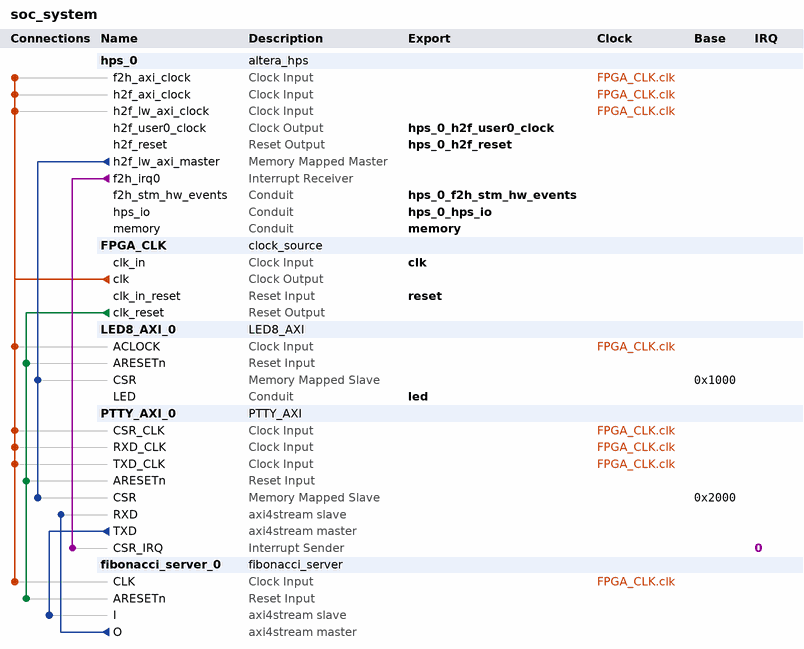
[diagram p0: system contents]
# Platform Designer (Qsys) system soc_system, Cyclone V 5CSEMA4U23C6
# Parameters at their usual value, and those the tool derives, are not listed.
package require -exact qsys 15.1
create_system soc_system
set_project_property DEVICE_FAMILY {Cyclone V}
set_project_property DEVICE 5CSEMA4U23C6

add_instance hps_0 altera_hps 15.1
set_instance_parameter_value hps_0 EMAC1_Mode RGMII
set_instance_parameter_value hps_0 EMAC1_PinMuxing {HPS I/O Set 0}
set_instance_parameter_value hps_0 F2SCLK_COLDRST_Enable false
set_instance_parameter_value hps_0 F2SCLK_DBGRST_Enable false
set_instance_parameter_value hps_0 F2SCLK_WARMRST_Enable false
set_instance_parameter_value hps_0 F2SINTERRUPT_Enable true
set_instance_parameter_value hps_0 F2S_Width 3
set_instance_parameter_value hps_0 FPGA_PERIPHERAL_OUTPUT_CLOCK_FREQ_EMAC0_GTX_CLK 100
set_instance_parameter_value hps_0 FPGA_PERIPHERAL_OUTPUT_CLOCK_FREQ_EMAC0_MD_CLK 100.0
set_instance_parameter_value hps_0 FPGA_PERIPHERAL_OUTPUT_CLOCK_FREQ_EMAC1_GTX_CLK 100
set_instance_parameter_value hps_0 FPGA_PERIPHERAL_OUTPUT_CLOCK_FREQ_EMAC1_MD_CLK 100.0
set_instance_parameter_value hps_0 HPS_PROTOCOL DDR3
set_instance_parameter_value hps_0 I2C0_Mode I2C
set_instance_parameter_value hps_0 I2C0_PinMuxing {HPS I/O Set 0}
set_instance_parameter_value hps_0 I2C1_Mode I2C
set_instance_parameter_value hps_0 I2C1_PinMuxing {HPS I/O Set 0}
set_instance_parameter_value hps_0 LWH2F_Enable true
set_instance_parameter_value hps_0 MEM_BANKADDR_WIDTH 3
set_instance_parameter_value hps_0 MEM_CLK_FREQ 400.0
set_instance_parameter_value hps_0 MEM_COL_ADDR_WIDTH 10
set_instance_parameter_value hps_0 MEM_DQ_WIDTH 32
set_instance_parameter_value hps_0 MEM_DRV_STR RZQ/6
set_instance_parameter_value hps_0 MEM_ROW_ADDR_WIDTH 15
set_instance_parameter_value hps_0 MEM_RTT_NOM RZQ/6
set_instance_parameter_value hps_0 MEM_RTT_WR {Dynamic ODT off}
set_instance_parameter_value hps_0 MEM_TCL 7
set_instance_parameter_value hps_0 MEM_TFAW_NS 37.5
set_instance_parameter_value hps_0 MEM_TRAS_NS 35.0
set_instance_parameter_value hps_0 MEM_TRCD_NS 13.75
set_instance_parameter_value hps_0 MEM_TRFC_NS 300.0
set_instance_parameter_value hps_0 MEM_TRP_NS 13.75
set_instance_parameter_value hps_0 MEM_VENDOR Other
set_instance_parameter_value hps_0 MEM_WTCL 7
set_instance_parameter_value hps_0 QSPI_Mode N/A
set_instance_parameter_value hps_0 QSPI_PinMuxing Unused
set_instance_parameter_value hps_0 REF_CLK_FREQ 25.0
set_instance_parameter_value hps_0 S2FCLK_USER0CLK_Enable true
set_instance_parameter_value hps_0 S2FCLK_USER2CLK 1
set_instance_parameter_value hps_0 S2F_Width 2
set_instance_parameter_value hps_0 SDIO_Mode {4-bit Data}
set_instance_parameter_value hps_0 SDIO_PinMuxing {HPS I/O Set 0}
set_instance_parameter_value hps_0 SPIM1_Mode {Single Slave Select}
set_instance_parameter_value hps_0 SPIM1_PinMuxing {HPS I/O Set 0}
set_instance_parameter_value hps_0 STM_Enable true
set_instance_parameter_value hps_0 TIMING_BOARD_AC_SKEW 0.02
set_instance_parameter_value hps_0 TIMING_BOARD_AC_TO_CK_SKEW 0.0
set_instance_parameter_value hps_0 TIMING_BOARD_DQ_TO_DQS_SKEW 0.0
set_instance_parameter_value hps_0 TIMING_BOARD_MAX_CK_DELAY 0.6
set_instance_parameter_value hps_0 TIMING_BOARD_MAX_DQS_DELAY 0.6
set_instance_parameter_value hps_0 TIMING_BOARD_SKEW_BETWEEN_DQS 0.02
set_instance_parameter_value hps_0 TIMING_BOARD_SKEW_CKDQS_DIMM_MAX 0.01
set_instance_parameter_value hps_0 TIMING_BOARD_SKEW_CKDQS_DIMM_MIN -0.01
set_instance_parameter_value hps_0 TIMING_BOARD_SKEW_WITHIN_DQS 0.02
set_instance_parameter_value hps_0 TIMING_TDH 125
set_instance_parameter_value hps_0 TIMING_TDQSCK 400
set_instance_parameter_value hps_0 TIMING_TDQSQ 120
set_instance_parameter_value hps_0 TIMING_TDS 50
set_instance_parameter_value hps_0 TIMING_TIH 250
set_instance_parameter_value hps_0 TIMING_TIS 175
set_instance_parameter_value hps_0 TIMING_TQSH 0.38
set_instance_parameter_value hps_0 UART0_Mode {No Flow Control}
set_instance_parameter_value hps_0 UART0_PinMuxing {HPS I/O Set 0}
set_instance_parameter_value hps_0 USB1_Mode SDR
set_instance_parameter_value hps_0 USB1_PinMuxing {HPS I/O Set 0}
set_instance_parameter_value hps_0 desired_cfg_clk_mhz 100.0
set_instance_parameter_value hps_0 desired_qspi_clk_mhz 370.0

add_instance FPGA_CLK clock_source 15.1
set_instance_parameter_value FPGA_CLK clockFrequency 50000000

add_instance LED8_AXI_0 LED8_AXI 1.0
set_instance_parameter_value LED8_AXI_0 C_ADDR_WIDTH 12
set_instance_parameter_value LED8_AXI_0 C_DATA_WIDTH 32
set_instance_parameter_value LED8_AXI_0 C_ID_WIDTH 12
set_instance_parameter_value LED8_AXI_0 DEFAULT_SEQ_0 24
set_instance_parameter_value LED8_AXI_0 DEFAULT_SEQ_1 36
set_instance_parameter_value LED8_AXI_0 DEFAULT_SEQ_2 66
set_instance_parameter_value LED8_AXI_0 DEFAULT_SEQ_3 129
set_instance_parameter_value LED8_AXI_0 DEFAULT_SEQ_4 66
set_instance_parameter_value LED8_AXI_0 DEFAULT_SEQ_5 36
set_instance_parameter_value LED8_AXI_0 DEFAULT_SEQ_6 0
set_instance_parameter_value LED8_AXI_0 DEFAULT_SEQ_7 0
set_instance_parameter_value LED8_AXI_0 DEFAULT_SEQ_LAST 5
set_instance_parameter_value LED8_AXI_0 DEFAULT_TIMER 100000000

add_instance PTTY_AXI_0 PTTY_AXI 1.0
set_instance_parameter_value PTTY_AXI_0 CSR_ADDR_WIDTH 12
set_instance_parameter_value PTTY_AXI_0 CSR_DATA_WIDTH 32
set_instance_parameter_value PTTY_AXI_0 CSR_ID_WIDTH 12
set_instance_parameter_value PTTY_AXI_0 RXD_BUF_DEPTH 7
set_instance_parameter_value PTTY_AXI_0 RXD_BYTES 4
set_instance_parameter_value PTTY_AXI_0 TXD_BUF_DEPTH 7
set_instance_parameter_value PTTY_AXI_0 TXD_BYTES 4

add_instance fibonacci_server_0 fibonacci_server 1.0
set_instance_parameter_value fibonacci_server_0 I_BYTES 4
set_instance_parameter_value fibonacci_server_0 O_BYTES 4

# connections
add_connection FPGA_CLK.clk fibonacci_server_0.CLK clock
add_connection FPGA_CLK.clk hps_0.f2h_axi_clock clock
add_connection FPGA_CLK.clk hps_0.h2f_axi_clock clock
add_connection FPGA_CLK.clk hps_0.h2f_lw_axi_clock clock
add_connection FPGA_CLK.clk LED8_AXI_0.ACLOCK clock
add_connection FPGA_CLK.clk PTTY_AXI_0.CSR_CLK clock
add_connection FPGA_CLK.clk PTTY_AXI_0.RXD_CLK clock
add_connection FPGA_CLK.clk PTTY_AXI_0.TXD_CLK clock
add_connection FPGA_CLK.clk_reset fibonacci_server_0.ARESETn reset
add_connection FPGA_CLK.clk_reset LED8_AXI_0.ARESETn reset
add_connection FPGA_CLK.clk_reset PTTY_AXI_0.ARESETn reset
add_connection hps_0.h2f_lw_axi_master LED8_AXI_0.CSR avalon
set_connection_parameter_value hps_0.h2f_lw_axi_master/LED8_AXI_0.CSR baseAddress 0x1000
add_connection hps_0.h2f_lw_axi_master PTTY_AXI_0.CSR avalon
set_connection_parameter_value hps_0.h2f_lw_axi_master/PTTY_AXI_0.CSR baseAddress 0x2000
add_connection fibonacci_server_0.O PTTY_AXI_0.RXD axi4stream
add_connection PTTY_AXI_0.TXD fibonacci_server_0.I axi4stream
add_connection hps_0.f2h_irq0 PTTY_AXI_0.CSR_IRQ interrupt
set_connection_parameter_value hps_0.f2h_irq0/PTTY_AXI_0.CSR_IRQ irqNumber 0

# exported interfaces
add_interface clk clock sink
set_interface_property clk EXPORT_OF FPGA_CLK.clk_in
add_interface hps_0_f2h_stm_hw_events conduit end
set_interface_property hps_0_f2h_stm_hw_events EXPORT_OF hps_0.f2h_stm_hw_events
add_interface hps_0_h2f_reset reset source
set_interface_property hps_0_h2f_reset EXPORT_OF hps_0.h2f_reset
add_interface hps_0_h2f_user0_clock clock source
set_interface_property hps_0_h2f_user0_clock EXPORT_OF hps_0.h2f_user0_clock
add_interface hps_0_hps_io conduit end
set_interface_property hps_0_hps_io EXPORT_OF hps_0.hps_io
add_interface led conduit end
set_interface_property led EXPORT_OF LED8_AXI_0.LED
add_interface memory conduit end
set_interface_property memory EXPORT_OF hps_0.memory
add_interface reset reset sink
set_interface_property reset EXPORT_OF FPGA_CLK.clk_in_reset

set_interconnect_requirement {$system} qsys_mm.clockCrossingAdapter HANDSHAKE
set_interconnect_requirement {$system} qsys_mm.maxAdditionalLatency 1

save_system soc_system.qsys
